# EAGLE schematic Micromouse2 (EAGLE 6.3)
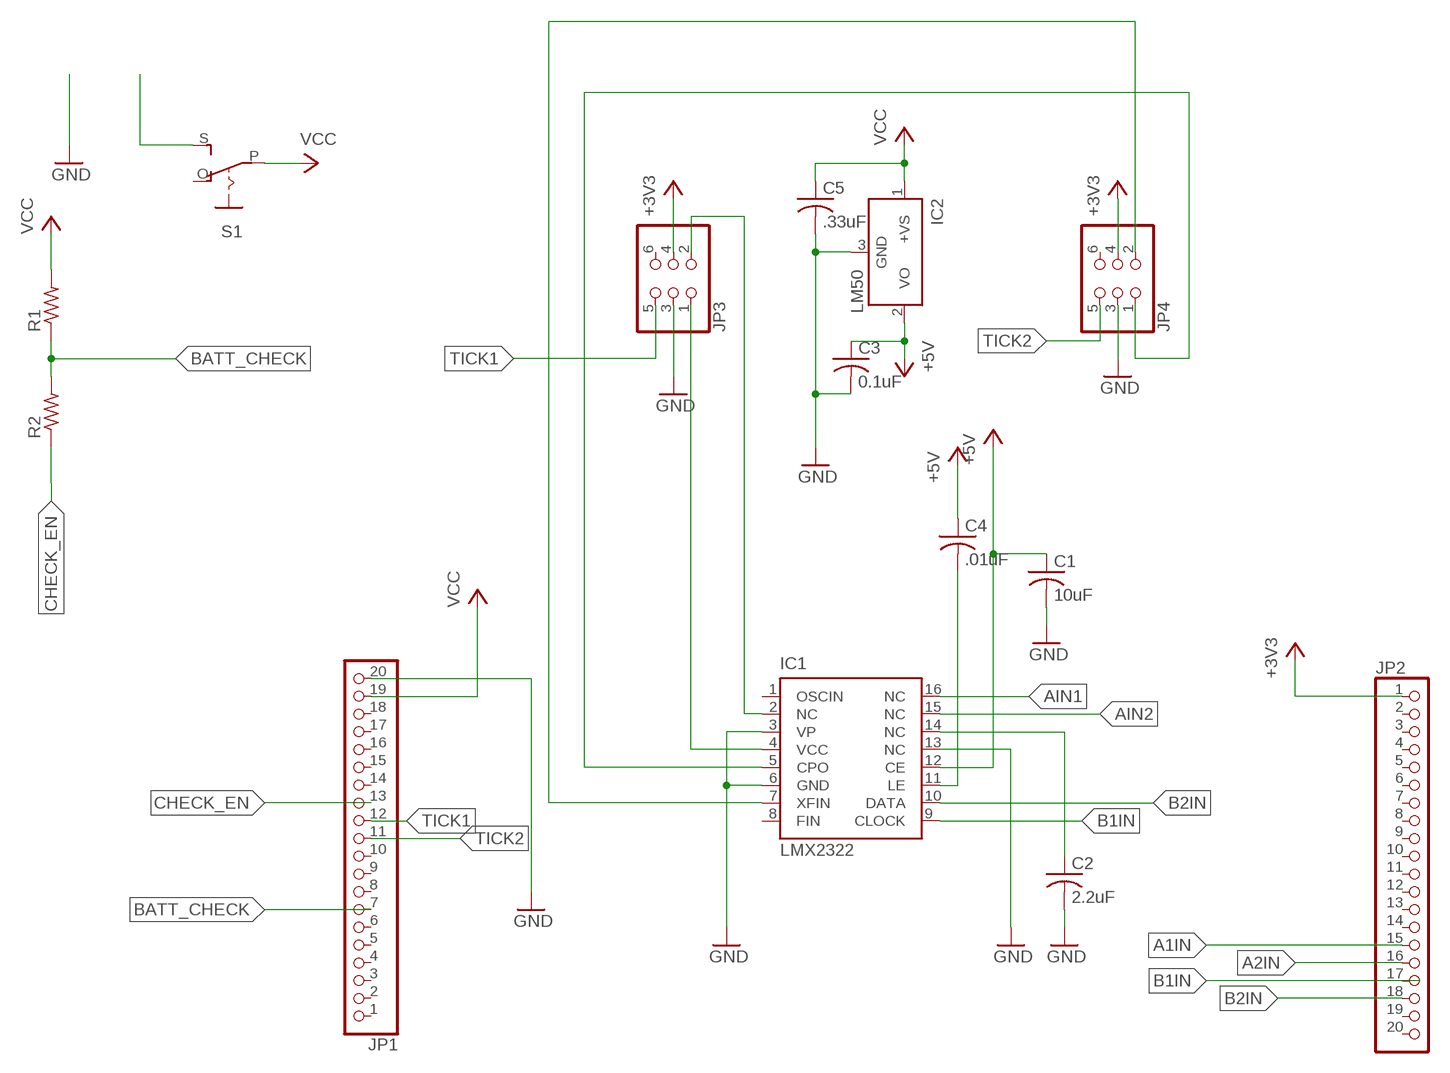
[diagram p0: schematic, sheet 1]

## Parts
C1  10uF  C-USC0805  [C0805]
C2  2.2uF  C-USC0805  [C0805]
C3  0.1uF  C-USC0805  [C0805]
C4  .01uF  C-USC0805  [C0805]
C5  .33uF  C-USC0805  [C0805]
IC1  LMX2322  [TSSOP16]
IC2  LM50  [SOT23]
JP1  PINHD-1X20  [1X20]
JP2  PINHD-1X20  [1X20]
JP3  PINHD-2X3  [2X03]
JP4  PINHD-2X3  [2X03]
R1  R-US_R0805  [R0805]
R2  R-US_R0805  [R0805]
S1  EG1218S  [EG1218]

## Nets
+3V3: JP2.1 JP3.4 JP4.4
+5V: C1.1 C3.1 C4.1 IC1.12(CE) IC2.2(VO)
A1IN: JP2.15
A2IN: JP2.16
AIN1: IC1.16(NC)
AIN2: IC1.15(NC)
B1IN: IC1.9(CLOCK)
B2IN: IC1.10(DATA) JP2.18
BATT_CHECK: JP1.7 R1.1 R2.2
CHECK_EN: JP1.13
GND: C1.2 C2.2 C3.2 C5.2 IC1.3(VP) IC1.6(GND) IC1.13(NC) IC2.3(GND) JP1.20 JP3.3 JP4.3
N$1: IC1.2(NC) JP3.2
N$2: C2.1 IC1.14(NC)
N$3: IC1.4(VCC) JP3.1
N$4: C4.2 IC1.11(LE)
N$5: IC1.7(XFIN) JP4.2
N$6: IC1.5(CPO) JP4.1
N$7: S1.S
N$10: R2.1
TICK1: JP1.12 JP3.5
TICK2: JP1.11 JP4.5
VCC: C5.1 IC2.1(+VS) JP1.19 R1.2 S1.P
Unconnected: IC1.1(OSCIN) IC1.8(FIN) JP1.1 JP1.2 JP1.3 JP1.4 JP1.5 JP1.6 JP1.8 JP1.9 JP1.10 JP1.14 JP1.15 JP1.16 JP1.17 JP1.18 JP2.2 JP2.3 JP2.4 JP2.5 JP2.6 JP2.7 JP2.8 JP2.9 JP2.10 JP2.11 JP2.12 JP2.13 JP2.14 JP2.17 JP2.19 JP2.20 JP3.6 JP4.6 S1.O

## Library data of the parts
C1-C5 = adafruit:C-US: CAPACITOR, American symbol
IC1 = national-semiconductor:LMX2322: PLLatinumTM 2.0 GHz Frequency Synthesizer for RF Personal Communications Source: LMX2322.pdf; OC_FARNELL: unknown; OC_NEWARK: unknown
IC2 = linear:LM50: SOT-23 Single-Supply Centigrade Temperature Sensor Vout = (10mV/°C x Temp °C) +5mmmV Source: http://cache.national.com/ds/LM/LM50.pdf
JP1 JP2 = adafruit:PINHD-1X20: PIN HEADER
JP3 JP4 = pinhead:PINHD-2X3: PIN HEADER
R1 R2 = adafruit:R-US_: RESISTOR, American symbol
S1 = adafruit:EG1218: SLIDING SWITCH 0.1" spacing through hole, vertical SPDT slide switch http://www.ladyada.net/library/pcb/eaglelibrary.html